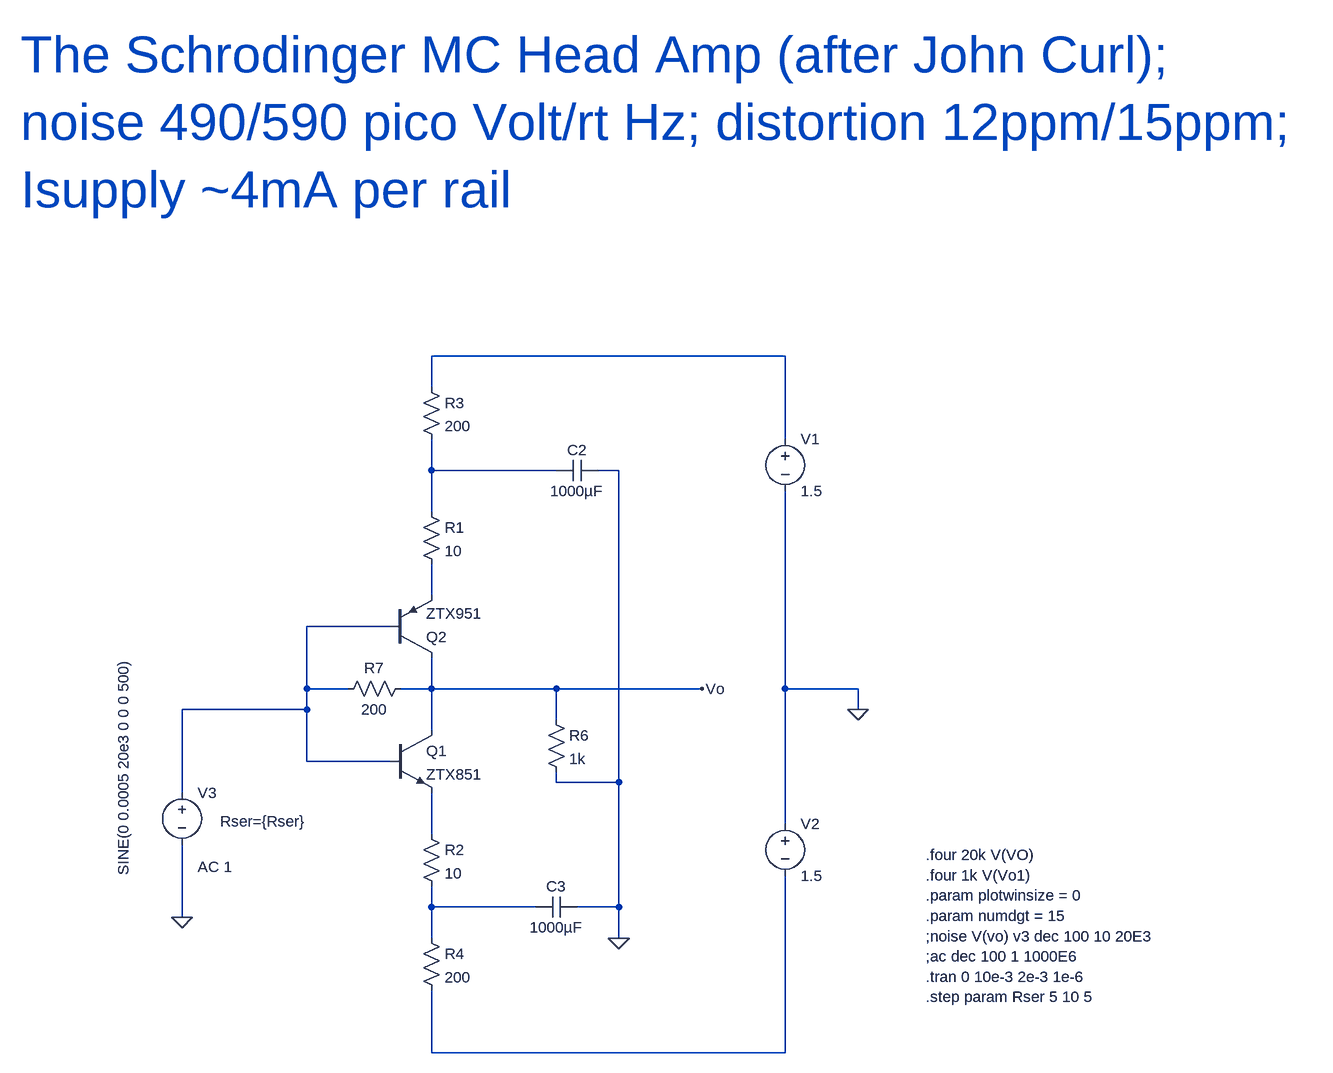
[diagram p0: schematic Schrodinger.asc]
Schrodinger.asc, the LTspice schematic file:
Version 4
SHEET 1 2616 1252
WIRE 192 176 -352 176
WIRE -352 224 -352 176
WIRE 192 304 192 176
WIRE -352 352 -352 304
WIRE -160 352 -352 352
WIRE -64 352 -96 352
WIRE -352 416 -352 352
WIRE -352 544 -352 496
WIRE -416 592 -544 592
WIRE -544 688 -544 592
WIRE -480 688 -544 688
WIRE -352 688 -352 640
WIRE -352 688 -400 688
WIRE -160 688 -352 688
WIRE 64 688 -160 688
WIRE 192 688 192 384
WIRE 304 688 192 688
WIRE -544 720 -544 688
WIRE -544 720 -736 720
WIRE 304 720 304 688
WIRE -160 736 -160 688
WIRE -352 752 -352 688
WIRE -544 800 -544 720
WIRE -416 800 -544 800
WIRE -160 832 -160 816
WIRE -64 832 -64 352
WIRE -64 832 -160 832
WIRE -736 848 -736 720
WIRE 192 896 192 688
WIRE -352 912 -352 848
WIRE -352 1024 -352 992
WIRE -192 1024 -352 1024
WIRE -64 1024 -64 832
WIRE -64 1024 -128 1024
WIRE -736 1040 -736 928
WIRE -352 1072 -352 1024
WIRE -64 1072 -64 1024
WIRE -352 1248 -352 1152
WIRE 192 1248 192 976
WIRE 192 1248 -352 1248
FLAG 304 720 0
FLAG -736 1040 0
FLAG -64 1072 0
FLAG 64 688 Vo
SYMBOL npn -416 752 R0
SYMATTR InstName Q1
SYMATTR Value ZTX851
SYMBOL pnp -416 640 M180
SYMATTR InstName Q2
SYMATTR Value ZTX951
SYMBOL res -368 400 R0
SYMATTR InstName R1
SYMATTR Value 10
SYMBOL res -368 896 R0
SYMATTR InstName R2
SYMATTR Value 10
SYMBOL res -368 208 R0
SYMATTR InstName R3
SYMATTR Value 200
SYMBOL res -368 1056 R0
SYMATTR InstName R4
SYMATTR Value 200
SYMBOL voltage 192 288 R0
WINDOW 123 0 0 Left 2
WINDOW 39 0 0 Left 2
SYMATTR InstName V1
SYMATTR Value 1.5
SYMBOL voltage 192 880 R0
WINDOW 123 0 0 Left 2
WINDOW 39 0 0 Left 2
SYMATTR InstName V2
SYMATTR Value 1.5
SYMBOL voltage -736 832 R0
WINDOW 3 -90 -191 VRight 2
WINDOW 123 24 130 Left 2
WINDOW 39 59 60 Left 2
SYMATTR Value SINE(0 0.0005 20e3 0 0 0 500)
SYMATTR Value2 AC 1
SYMATTR SpiceLine Rser={Rser}
SYMATTR InstName V3
SYMBOL cap -96 336 R90
WINDOW 0 0 32 VBottom 2
WINDOW 3 32 32 VTop 2
SYMATTR InstName C2
SYMATTR Value 1000µF
SYMBOL cap -128 1008 R90
WINDOW 0 0 32 VBottom 2
WINDOW 3 32 32 VTop 2
SYMATTR InstName C3
SYMATTR Value 1000µF
SYMBOL res -176 720 R0
SYMATTR InstName R6
SYMATTR Value 1k
SYMBOL res -384 672 R90
WINDOW 0 0 56 VBottom 2
WINDOW 3 32 56 VTop 2
SYMATTR InstName R7
SYMATTR Value 200
TEXT 408 944 Left 2 !.four 20k V(VO)\n.four 1k V(Vo1)\n.param plotwinsize = 0\n.param numdgt = 15\n;noise V(vo) v3 dec 100 10 20E3\n;ac dec 100 1 1000E6\n.tran 0 10e-3 2e-3 1e-6\n.step param Rser 5 10 5
TEXT -984 -288 Left 6 ;The Schrodinger MC Head Amp (after John Curl); \nnoise 490/590 pico Volt/rt Hz; distortion 12ppm/15ppm; \nIsupply ~4mA per rail

The netlist it stands for:
* Schrodinger.asc
Q1 Vo N004 N005 0 ZTX851
Q2 Vo N004 N003 0 ZTX951
R1 N002 N003 10
R2 N005 N006 10
R3 N001 N002 200
R4 N006 N007 200
V1 N001 0 1.5
V2 0 N007 1.5
V3 N004 0 SINE(0 0.0005 20e3 0 0 0 500) AC 1 Rser={Rser}
C2 0 N002 1000µF
C3 0 N006 1000µF
R6 Vo 0 1k
R7 Vo N004 200
.model NPN NPN
.model PNP PNP
.lib standard.bjt
.four 20k V(VO)
.four 1k V(Vo1)
.param plotwinsize = 0
.param numdgt = 15
;noise V(vo) v3 dec 100 10 20E3
;ac dec 100 1 1000E6
.tran 0 10e-3 2e-3 1e-6
.step param Rser 5 10 5
* The Schrodinger MC Head Amp (after John Curl);
* noise 490/590 pico Volt/rt Hz; distortion 12ppm/15ppm;
* Isupply ~4mA per rail
.backanno
.end